# EAGLE design inga_charger (EAGLE 7.2.0)
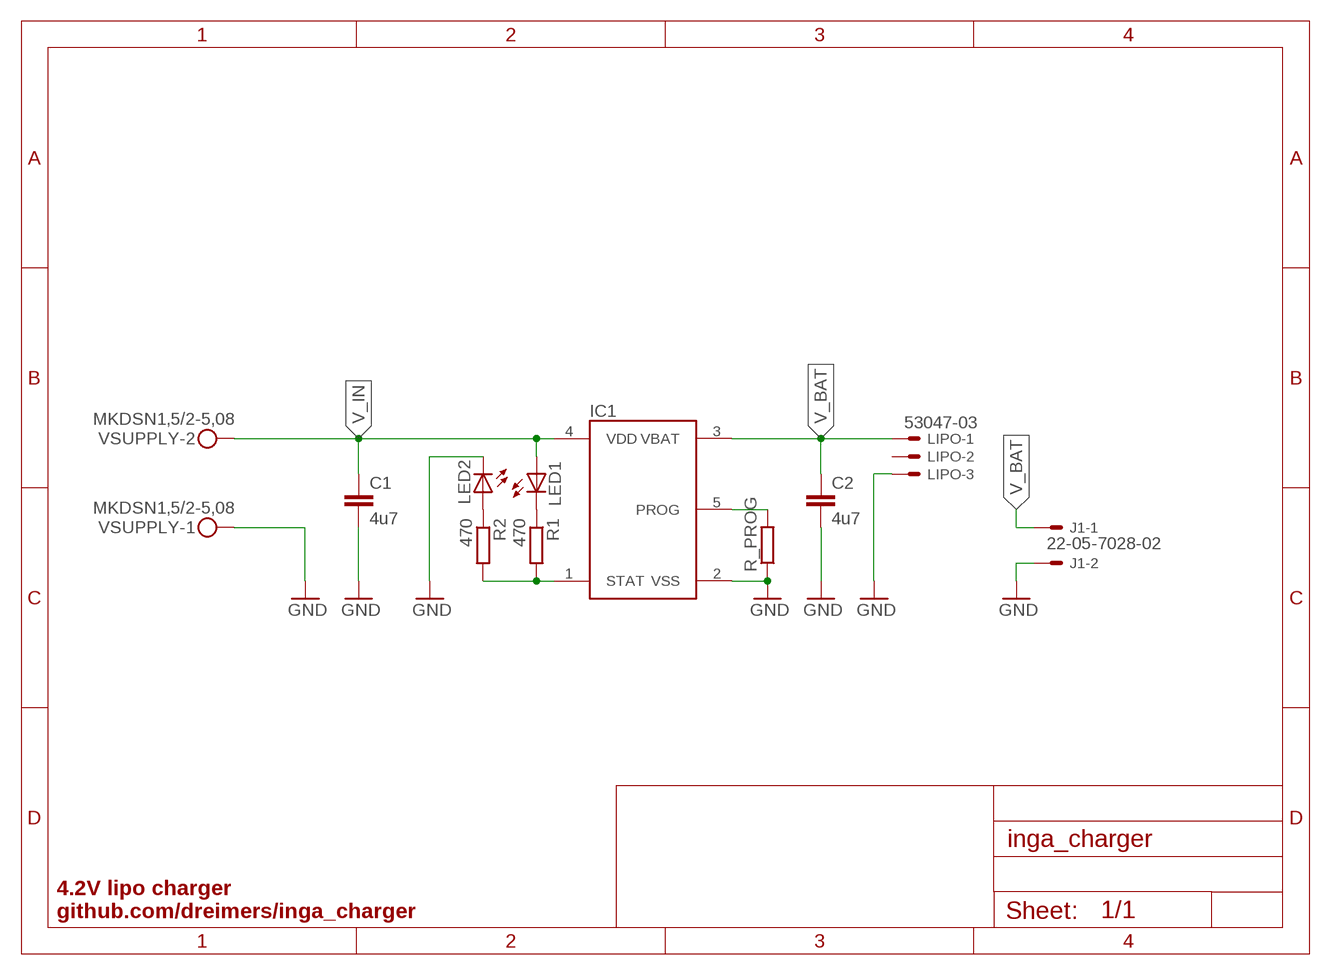
[diagram p0: schematic, sheet 1]

## Parts
C1  4u7  C-EUC0805  [C0805]
C2  4u7  C-EUC0805  [C0805]
IC1  MCP73831/2  [SOT23-5]
J1  22-05-7028-02  [7395-02]
LED1  LEDCHIP-LED0603  [CHIP-LED0603]
LED2  LEDCHIP-LED0603  [CHIP-LED0603]
LIPO  53047-03  [53047-03]
R1  470  R-EU_R0402  [R0402]
R2  470  R-EU_R0402  [R0402]
R_PROG  R-EU_R0603  [R0603]
VSUPPLY  MKDSN1,5/2-5,08  [MKDSN1,5/2-5,08]

## Nets
GND: C1.2 C2.2 IC1.2(VSS) J1.2 LED2.C LIPO.3 R_PROG.1 VSUPPLY.1
N$1: LED1.C R1.1
N$2: IC1.1(STAT) R1.2 R2.2
N$4: IC1.5(PROG) R_PROG.2
N$5: LED2.A R2.1
V_BAT: C2.1 IC1.3(VBAT) J1.1 LIPO.1
V_IN: C1.1 IC1.4(VDD) LED1.A VSUPPLY.2
Unconnected: LIPO.2

## Notes on the sheet
- 4.2V lipo charger
  github.com/dreimers/inga_charger

## Library data of the parts
C1 C2 = rcl:C-EU: CAPACITOR, European symbol
IC1 = mcp73831:MCP73831/2: Miniature Single-Cell, Fully Integrated Li-Ion, Li-Polymer Charge Management Controllers http://www.microchip.com/wwwproducts/Devices.aspx?product=MCP73831
J1 = con-molex:22-?-02: CONNECTOR wire to board 2.54 mm (.1 inch) pitch header; OC_FARNELL: 9731601; OC_NEWARK: unknown
LED1 LED2 = led:LED: LED OSRAM: - CHIPLED LG R971, LG N971, LY N971, LG Q971, LY Q971, LO R971, LY R971 LH N974, LH R974 LS Q976, LO Q976, LY Q976 LO Q996 - Hyper CHIPLED LW Q18S LB Q993, LB Q99A, LB R99A - SideLED LS A670, LO A670, LY A670, LG A670, LP A670 LB A673, LV A673, LT A673, LW A673 LH A674 LY A675 LS A676, LA A676, LO A676, LY A676, LW A676 LS A679, LY A679, LG A679 - Hyper Micro SIDELED® LS Y876, LA Y876, LO Y876, LY Y876 LT Y87S - SmartLED LW L88C, LW L88S LB L89C, LB L89S, LG L890 LS L89K, LO L89K, LY L89K LS L896, LA L896, LO L896, LY L896 - TOPLED LS T670, LO T670, LY T670, LG T670, LP T670 LSG T670, LSP T670, LSY T670, LOP T670, LYG T670 LG T671, LOG T671, LSG T671 LB T673, LV T673, LT T673, LW T673 LH T674 LS T676, LA T676, LO T676, LY T676, LB T676, LH T676, LSB T676, LW T676 LB T67C, LV T67C, LT T67C, LS T67K, LO T67K, LY T67K, LW E67C LS E67B, LA E67B, LO E67B, LY E67B, LB E67C, LV E67C, LT E67C LW T67C LS T679, LY T679, LG T679 LS T770, LO T770, LY T770, LG T770, LP T770 LB T773, LV T773, LT T773, LW T773 LH T774 LS E675, LA E675, LY E675, LS T675 LS T776, LA T776, LO T776, LY T776, LB T776 LHGB T686 LT T68C, LB T68C - Hyper Mini TOPLED® LB M676 - Mini TOPLED Santana® LG M470 LS M47K, LO M47K, LY M47K Source: http://www.osram.convergy.de LUXEON: - LUMILED® LXK2-PW12-R00, LXK2-PW12-S00, LXK2-PW14-U00, LXK2-PW14-V00 LXK2-PM12-R00, LXK2-PM12-S00, LXK2-PM14-U00 LXK2-PE12-Q00, LXK2-PE12-R00, LXK2-PE12-S00, LXK2-PE14-T00, LXK2-PE14-U00 LXK2-PB12-K00, LXK2-PB12-L00, LXK2-PB12-M00, LXK2-PB14-N00, LXK2-PB14-P00, LXK2-PB14-Q00 LXK2-PR12-L00, LXK2-PR12-M00, LXK2-PR14-Q00, LXK2-PR14-R00 LXK2-PD12-Q00, LXK2-PD12-R00, LXK2-PD12-S00 LXK2-PH12-R00, LXK2-PH12-S00 LXK2-PL12-P00, LXK2-PL12-Q00, LXK2-PL12-R00 Source: www.luxeon.com KINGBRIGHT: KA-3528ASYC Source: www.kingbright.com
LIPO = con-molex:53?-03: CONNECTOR wire to board 1.25 mm (.049 inch) pitch header; MPN: 530470310; OC_FARNELL: 9732853; OC_NEWARK: 14R5412
R1 R2 R_PROG = rcl:R-EU_: RESISTOR, European symbol
VSUPPLY = con-phoenix-508:MKDSN1,5/2-5,08: MKDSN 1,5/ 2-5,08 Printklemme Nennstrom: 13,5 A Nennspannung: 250 V Rastermaß: 5,08 mm Polzahl: 2 Anschlussart: Schraubanschluss Montage: Löten Anschlussrichtung Leiter/Platine: 0 ° Artikelnummer: 1729128 Source: http://eshop.phoenixcontact.com .. 1729128.pdf

## Board
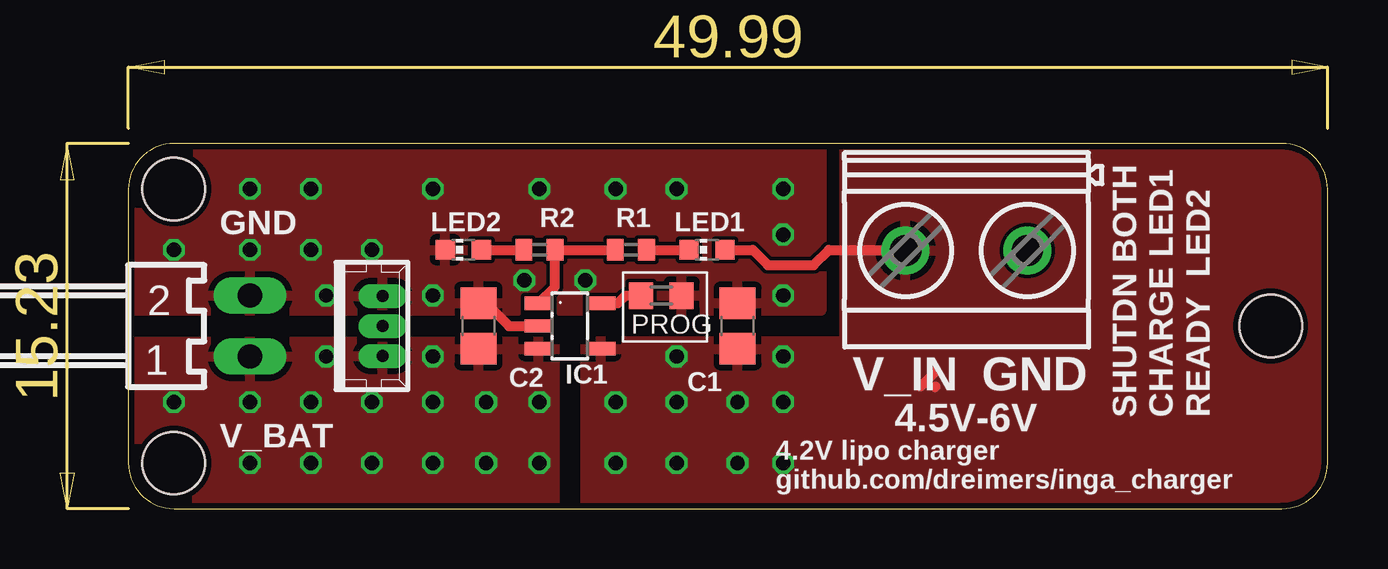
[diagram p1: board, top side]
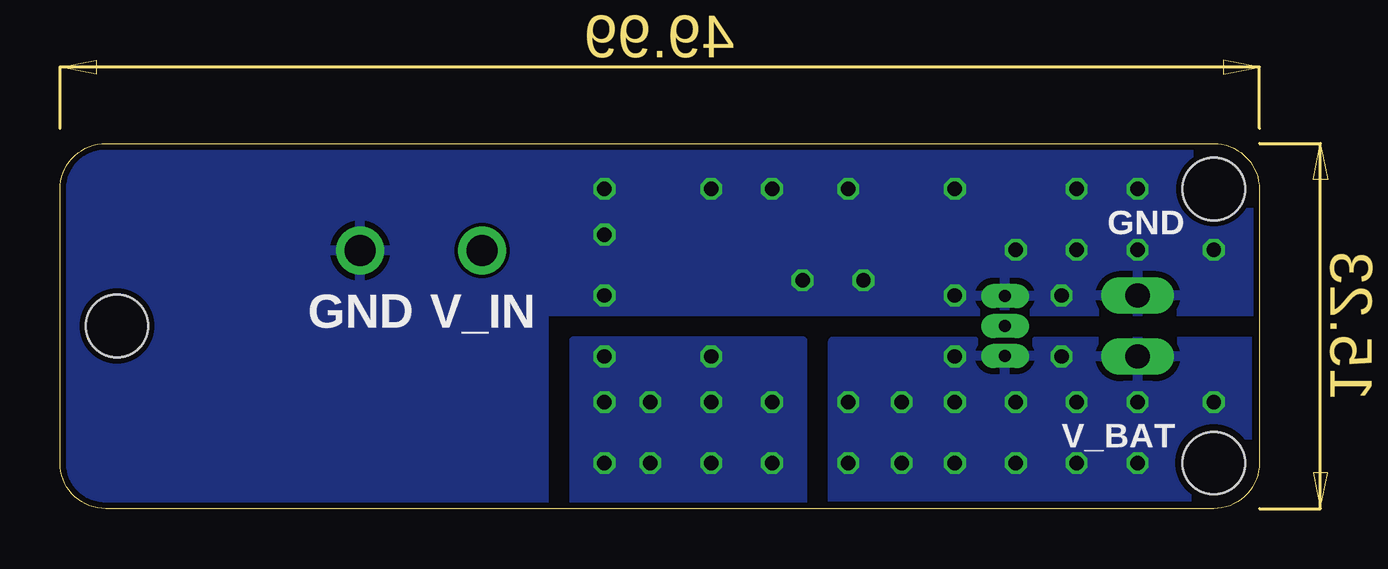
[diagram p2: board, bottom side, seen from below]

Size 49.99 x 15.23 mm. Coordinates in mm from the lower left corner, seen from the top.
Outline: 1.91,0 48.09,0 arc90 49.99,1.91 49.99,13.32 arc90 48.09,15.23 1.91,15.23 arc90 0,13.32 0,1.91 arc90 1.91,0
Copper layers (1*16): Top 0.035mm / dielectric 1.5mm / Bottom 0.035mm
Design rules "ITEADstudio_DRC *": minimum track width 6mil, minimum drill 12mil, track to track 6mil, track to pad 6mil, pad to pad 6mil, via to via 6mil, smd to smd 0mil, copper to edge 10mil, drill to drill 10mil, minimum pad ring 10mil, minimum via ring 6mil, stop-mask expansion 2mil, vias tented up to drill 100mil, thermal gap 10mil
Holes 2.6 mm at 47.62,7.62 1.9,13.34 1.9,1.91

### Footprints (pad centres in the part's own frame; a part is rotated, then mirrored left to right if it is on the bottom)
C0805 = smd 1.3 x 1.5: 1 -0.95,0; 2 0.95,0
SOT23-5 = smd 0.55 x 1.2: 1 -0.95,-1.3; 2 0,-1.3; 3 0.95,-1.3; 4 0.95,1.3; 5 -0.95,1.3
7395-02 = drill 1.016 long: 1 1.27,0; 2 -1.27,0
CHIP-LED0603 = smd 0.8 x 0.8: A 0,-0.75; C 0,0.75
53047-03 = drill 0.5 pad 0.698 long: 1 1.25,0.45; 2 0,0.45; 3 -1.25,0.45
R0402 = smd 0.7 x 0.9: 1 -0.65,0; 2 0.65,0
R0603 = smd 1 x 1.1: 1 -0.85,0; 2 0.85,0
MKDSN1,5/2-5,08 = drill 1.3 pad 2: 1 -2.561,0.025; 2 2.519,0.025

### Placement (x,y rotation side)
C1  25.39,7.62 90 top
C2  14.6,7.62 90 top
IC1  18.4,7.62 270 top
J1  5.07,7.62 270 top
LED1  24.12,10.79 90 top
LED2  13.96,10.79 90 top
LIPO  10.15,7.62 270 top
R1  20.94,10.79 180 top
R2  17.13,10.79 0 top
R_PROG  22.21,8.89 180 top
VSUPPLY  34.91,10.79 180 top

### Tracks (layer width: path | path; a pad name or v marks a point on that pad's centre or on a via)
GND  (via drill 0.6)
  Top 0.406: C2.2 14.92,8.57 15.87,7.62 IC1.2
  other vias: 27.29,11.43 12.69,8.89 19.04,9.53 8.25,8.89 27.29,8.89 7.61,10.79 5.07,10.79 1.9,10.79 10.15,10.79 5.07,13.34 7.61,13.34 20.31,13.34 27.29,13.34 17.13,13.34 12.69,13.34 22.85,13.34 16.5,9.53
  pour Bottom: -0.01,15.24 29.83,15.24 29.83,8.26 -0.01,8.26
  pour Top: -0.01,15.24 28.88,15.24 28.88,8.26 -0.01,8.26
  pour Bottom: 50.16,15.24 29.83,15.24 29.83,0 50.16,0
N$1
  Top 0.406: R1.1 LED1.C
N$2
  Top 0.406: IC1.1 17.79,9.25 R2.2 R1.2
N$4
  Top 0.406: IC1.5 20.41,8.57 20.73,8.89 R_PROG.2
N$5
  Top 0.406: LED2.A R2.1
V_BAT  (via drill 0.6)
  other vias: 12.69,6.35 8.25,6.35 12.69,4.45 10.15,4.45 7.61,4.45 5.07,4.45 1.9,4.45 17.13,4.45 5.07,1.91 7.61,1.91 10.15,1.91 12.69,1.91 17.13,1.91 14.91,4.45 14.91,1.91
  pour Bottom (isolate 0.305): 17.77,0 17.77,6.99 -0.01,6.99 -0.01,0
  pour Top: -0.01,6.99 17.77,6.99 17.77,0 -0.01,0
V_IN  (via drill 0.6)
  Top 0.406: 33.65,5.71 33.01,5.08 | 33.65,5.08 33.62,5.06 | LED1.A 26.02,10.79 26.66,10.16 28.56,10.16 29.2,10.79 32.37,10.79 VSUPPLY.2
  other vias: 20.31,4.45 22.85,4.45 25.39,4.45 22.85,6.35 27.29,4.45 27.29,6.35 20.31,1.91 22.85,1.91 25.39,1.91 27.29,1.91
  pour Bottom (isolate 0.254): 28.56,6.99 28.56,0 19.04,0 19.04,6.99
  pour Top: 19.04,6.99 19.04,0 38.09,0 38.09,6.99
  pour Top: 29.83,0 50.16,0 50.16,15.24 29.83,15.24

### Text on the board
tNames: GND | PROG | V_IN | GND | 4.5V-6V | SHUTDN BOTH / CHARGE LED1 / READY LED2 | V_BAT | 4.2V lipo charger / github.com/dreimers/inga_charger
bNames: GND | V_IN | GND | V_BAT